# EAGLE design ECE411_G16_V7 (EAGLE 9.2.1)
Version 6: Added bypass capacitors to uC +Vcc, added test points for I2C.
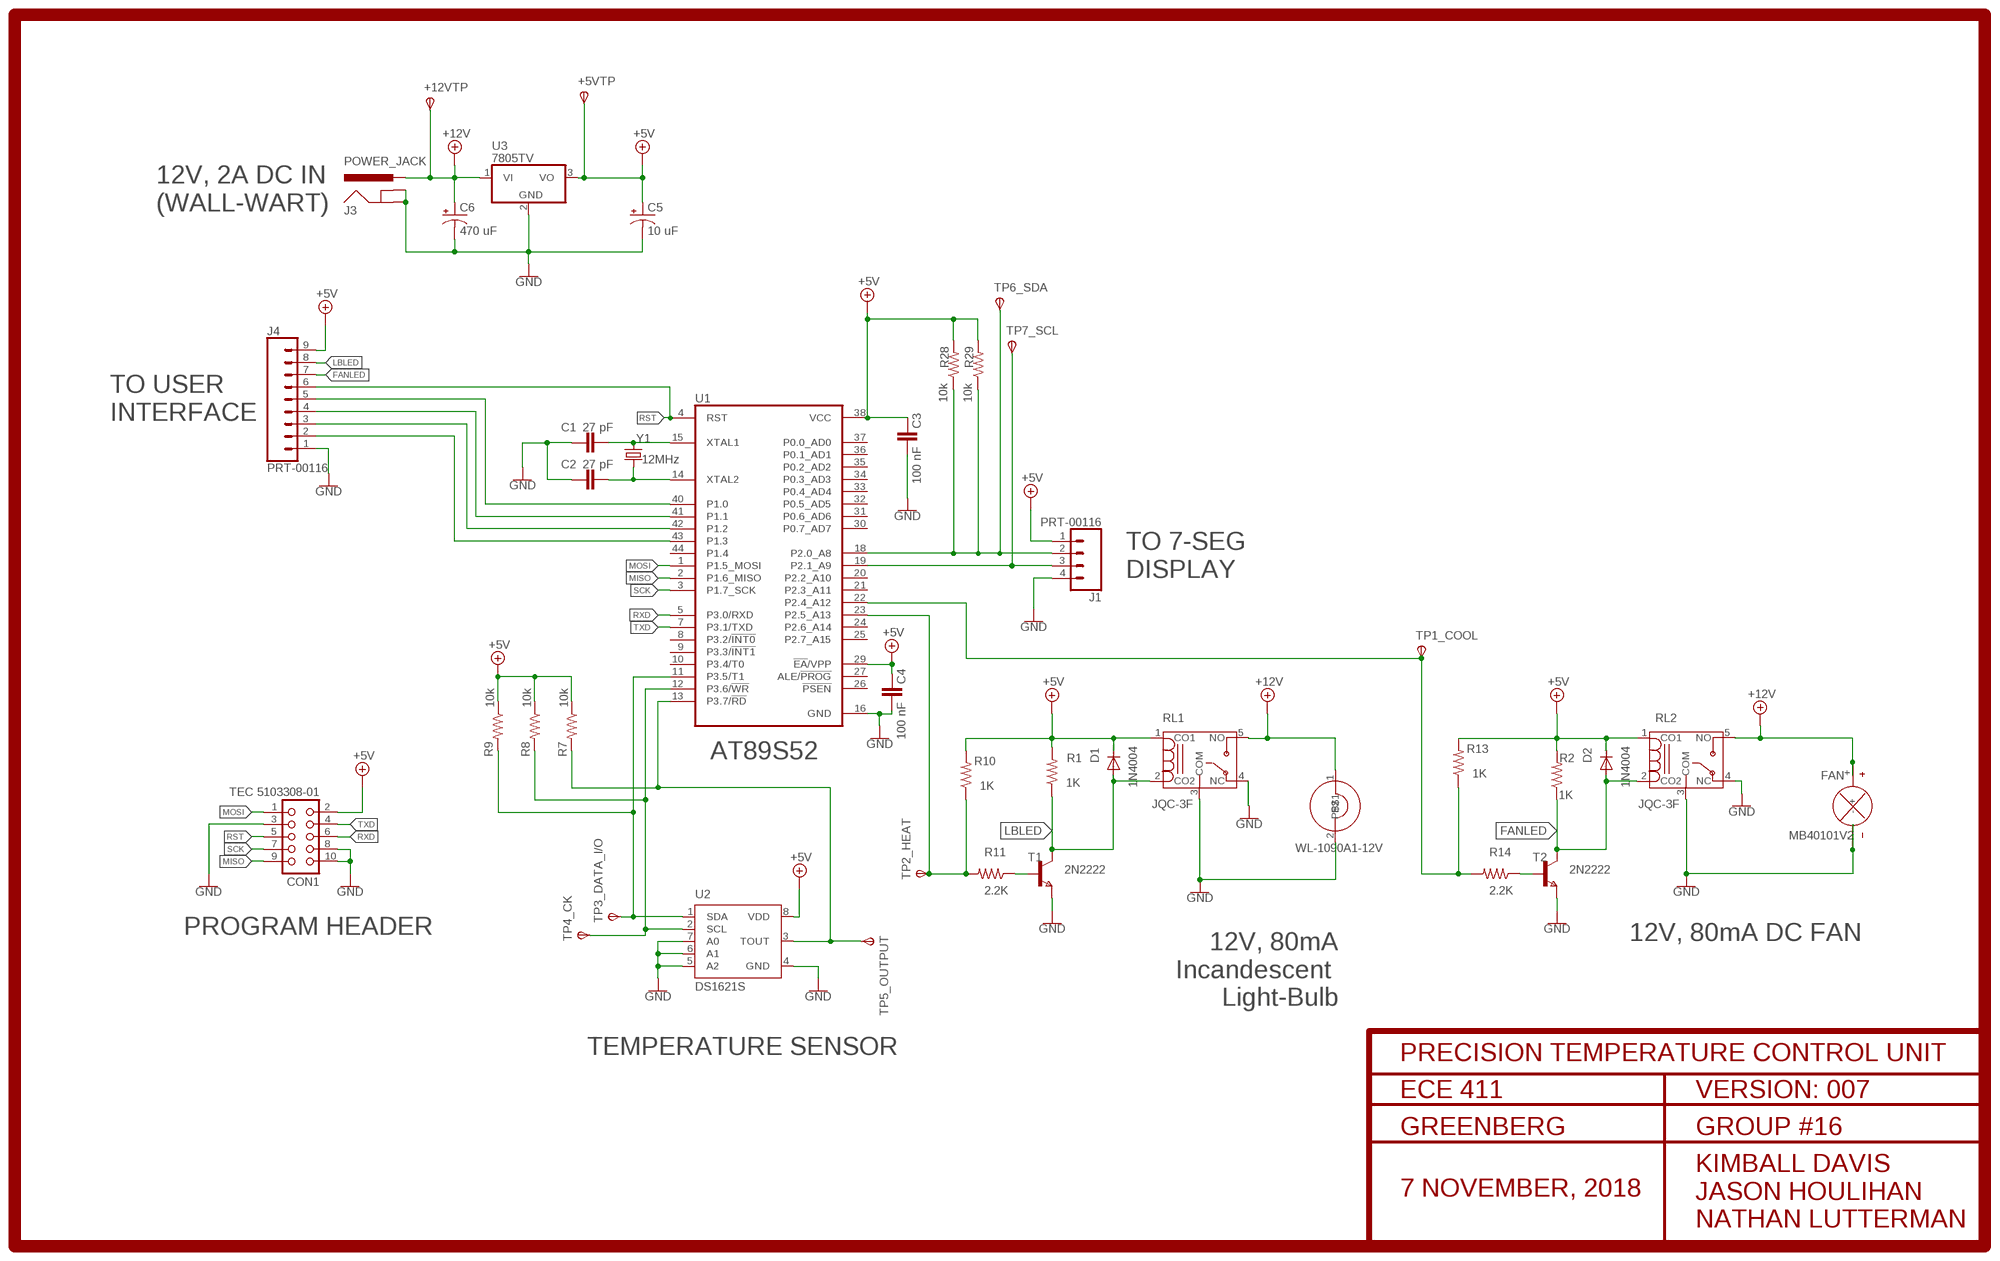
[diagram p0: schematic, sheet 1]

## Parts
+5VTP  TPSTP20SQ  [TP20SQ]
+12VTP  TPSTP20SQ  [TP20SQ]
C1  27 pF  CAPACITOR_0603_M  [RESC0603_M]
C2  27 pF  CAPACITOR_0603_M  [RESC0603_M]
C3  100 nF  CAPACITOR_0603_M  [RESC0603_M]
C4  100 nF  CAPACITOR_0603_M  [RESC0603_M]
C5  10 uF  CPOL-USTT2D6  [TT2D6]
C6  470 uF  CPOL-USTT5D11  [TT5D11]
CON1  TEC 5103308-01  CON10  [CON10]
D1  1N4004  [DO41-10]
D2  1N4004  [DO41-10]
J1  PRT-00116  CONN_04  [1X04]
J3  POWER_JACK  [POWER_JACK_PTH]
J4  PRT-00116  CONN_09  [1X09]
LIGHTBULB  LIGHTBULB  [JUMPER2]
MB40101V2  FAN  [FAN]
R1  1K  R-US_R0603  [R0603]
R2  1K  R-US_R0603  [R0603]
R7  10k  R-US_R0603  [R0603]
R8  10k  R-US_R0603  [R0603]
R9  10k  R-US_R0603  [R0603]
R10  1K  R-US_R0603  [R0603]
R11  2.2K  R-US_R0603  [R0603]
R13  1K  R-US_R0603  [R0603]
R14  2.2K  R-US_R0603  [R0603]
R28  10k  R-US_R0603  [R0603]
R29  10k  R-US_R0603  [R0603]
RL1  JQC-3F  [T073]
RL2  JQC-3F  [T073]
T1  2N2222  NPNSOT23  [SOT-23]
T2  2N2222  NPNSOT23  [SOT-23]
TP1_COOL  TPSTP20SQ  [TP20SQ]
TP2_HEAT  TPSTP20SQ  [TP20SQ]
TP3_DATA_I/O  TPSTP20SQ  [TP20SQ]
TP4_CK  TPSTP20SQ  [TP20SQ]
TP5_OUTPUT  TPSTP20SQ  [TP20SQ]
TP6_SDA  TPSTP20SQ  [TP20SQ]
TP7_SCL  TPSTP20SQ  [TP20SQ]
U1  AT89S52  AT89S51-24P  [TQFP44]
U2  DS1621S  [SO08]
U3  7805TV  [TO220V]
Y1  12MHz  CRYSTAL-12MHZ"  [CRYSTAL-SMD-5X3.2-4PAD]

## Nets
+5V: +5VTP.TP(PP) C3.2 C4.2 C5.+ CON1.2 D1.C D2.C J1.1 J4.9 R1.2 R2.2 R7.1 R8.1 R9.1 R10.2 R13.2 R28.2 R29.2 RL1.1(CO1) RL2.1(CO1) U1.29(!EA!/VPP) U1.38(VCC) U2.8(VDD) U3.3(VO)
+12V: +12VTP.TP(PP) C6.+ J3.PWR LIGHTBULB.1 MB40101V2.+ RL1.5(NO) RL2.5(NO) U3.1(VI)
FANLED: D2.A J4.7 R2.1 RL2.2(CO2) T2.1(C)
GND: C1.1 C2.1 C3.1 C4.1 C5.- C6.- CON1.3 CON1.8 CON1.10 J1.4 J3.GND J3.GNDBREAK J4.1 LIGHTBULB.2 MB40101V2.- RL1.3(COM) RL1.4(NC) RL2.3(COM) RL2.4(NC) T1.2(E) T2.2(E) U1.16(GND) U2.4(GND) U2.5(A2) U2.6(A1) U2.7(A0) U3.2(GND)
LBLED: D1.A J4.8 R1.1 RL1.2(CO2) T1.1(C)
MISO: CON1.9 U1.2(P1.6_MISO)
MOSI: CON1.1 U1.1(P1.5_MOSI)
N$1: C1.2 U1.15(XTAL1) Y1.1
N$2: C2.2 U1.14(XTAL2) Y1.3
N$3: J1.2 R28.1 R29.1 TP6_SDA.TP(PP) U1.18(P2.0_A8)
N$4: J1.3 TP7_SCL.TP(PP) U1.19(P2.1_A9)
N$9: R7.2 TP5_OUTPUT.TP(PP) U1.13(P3.7/!RD) U2.3(TOUT)
N$10: R8.2 TP4_CK.TP(PP) U1.12(P3.6/!WR) U2.2(SCL)
N$11: R9.2 TP3_DATA_I/O.TP(PP) U1.11(P3.5/T1) U2.1(SDA)
N$12: R10.1 R11.2 TP2_HEAT.TP(PP) U1.23(P2.5_A13)
N$13: R11.1 T1.3(B)
N$16: R13.1 R14.2 TP1_COOL.TP(PP) U1.22(P2.4_A12)
N$17: R14.1 T2.3(B)
N$34: J4.5 U1.40(P1.0)
N$35: J4.4 U1.41(P1.1)
N$36: J4.3 U1.42(P1.2)
N$37: J4.2 U1.43(P1.3)
RST: CON1.5 J4.6 U1.4(RST)
RXD: CON1.6 U1.5(P3.0/RXD)
SCK: CON1.7 U1.3(P1.7_SCK)
TXD: CON1.4 U1.7(P3.1/TXD)
Unconnected: U1.8(P3.2/!INT0) U1.9(P3.3/!INT1) U1.10(P3.4/T0) U1.20(P2.2_A10) U1.21(P2.3_A11) U1.24(P2.6_A14) U1.25(P2.7_A15) U1.26(!PSEN) U1.27(ALE/!PROG) U1.30(P0.7_AD7) U1.31(P0.6_AD6) U1.32(P0.5_AD5) U1.33(P0.4_AD4) U1.34(P0.3_AD3) U1.35(P0.2_AD2) U1.36(P0.1_AD1) U1.37(P0.0_AD0) U1.44(P1.4)

## Notes on the sheet
- 12V, 2A DC IN
  (WALL-WART)
- TO USER
  INTERFACE
- TO 7-SEG 
  DISPLAY
- AT89S52
- WL-1090A1-12V
- PROGRAM HEADER | 12V, 80mA DC FAN
- 12V, 80mA
  Incandescent 
  Light-Bulb
- TEMPERATURE SENSOR

## Power pins joined to a net without a drawn wire
GND: U1.17(GND)

## Library data of the parts
+5VTP +12VTP TP1_COOL TP2_HEAT TP3_DATA_I/O TP4_CK TP5_OUTPUT TP6_SDA TP7_SCL = testpad:TPS: TEST PIN
C1-C4 = Nordic_nRF:CAPACITOR: Generic chip capacitor
C5 C6 = rcl:CPOL-US: POLARIZED CAPACITOR, American symbol; SPICEPREFIX: C
CON1 = con-harting:CON10: CONNECTOR; OC_FARNELL: unknown; OC_NEWARK: unknown
D1 D2 = diode:1N4004: DIODE general purpose rectifier, 1 A
J1 = SparkFun-Connectors:CONN_04: Multi connection point. Often used as Generic Header-pin footprint for 0.1 inch spaced/style header connections On any of the 0.1 inch spaced packages, you can populate with these: Break Away Headers - Straight <https://www.sparkfun.com/products/116> (PRT-00116) Break Away Male Headers - Right Angle <https://www.sparkfun.com/products/553> (PRT-00553) Female Headers <https://www.sparkfun.com/products/115> (PRT-00115) Break Away Headers - Machine Pin <https://www.sparkfun.com/products/117> (PRT-00117) Break Away Female Headers - Swiss Machine Pin <https://www.sparkfun.com/products/743> (PRT-00743) For SCREWTERMINALS and SPRING TERMINALS visit here: Screw Terimnals on SparkFun.com <https://www.sparkfun.com/search/results?term=Screw+Terminals> (5mm/3.5mm/2.54mm spacing) This device is also useful as a general connection point to wire up your design to another part of your project. Our various solder wires solder well into these plated through hole pads. Hook-Up Wire - Assortment (Stranded, 22 AWG) <https://www.sparkfun.com/products/11375> (PRT-11375) Hook-Up Wire - Assortment (Solid Core, 22 AWG) <https://www.sparkfun.com/products/11367> (PRT-11367) View the entire wire category on our website here <https://www.sparkfun.com/categories/141> Special notes: Molex polarized connector foot print use with SKU : PRT-08231 with associated crimp pins and housings. 1MM SMD Version SKU: PRT-10208; PROD_ID: CONN-09696
J3 = SparkFun-Connectors:POWER_JACK: Power Jack Connector This is the standard 5.5mm barrel jack for power. The PTH is the most common, proven, reliable, footprint. The Slot footprint only works if the mill layer is transmitted to the PCB fab house so be warned. Here are the connectors we sell at SparkFun: DC Barrel Power Jack/Connector <https://www.sparkfun.com/products/119> (PRT-00119) DC Barrel Power Jack/Connector (SMD) <https://www.sparkfun.com/products/12748> (PRT-12748) DC Barrel Jack Adapter - Breadboard Compatible <https://www.sparkfun.com/products/10811> (PRT-10811) It is used on this SparkFun product (and many, many others): SparkFun RedBoard - Programmed with Arduino <https://www.sparkfun.com/products/12757> (DEV-12757) Also, if you need a mating power supply or connector, please check these out: Wall Adapter Power Supply - 9VDC 650mA <https://www.sparkfun.com/products/298> (TOL-00298) DC Barrel Jack Adapter - Male <https://www.sparkfun.com/products/10287> (PRT-10287); PROD_ID: CONN-08197
J4 = SparkFun-Connectors:CONN_09: Multi connection point. Often used as Generic Header-pin footprint for 0.1 inch spaced/style header connections On any of the 0.1 inch spaced packages, you can populate with these: Break Away Headers - Straight <https://www.sparkfun.com/products/116> (PRT-00116) Break Away Male Headers - Right Angle <https://www.sparkfun.com/products/553> (PRT-00553) Female Headers <https://www.sparkfun.com/products/115> (PRT-00115) Break Away Headers - Machine Pin <https://www.sparkfun.com/products/117> (PRT-00117) Break Away Female Headers - Swiss Machine Pin <https://www.sparkfun.com/products/743> (PRT-00743) For SCREWTERMINALS and SPRING TERMINALS visit here: Screw Terimnals on SparkFun.com <https://www.sparkfun.com/search/results?term=Screw+Terminals> (5mm/3.5mm/2.54mm spacing) This device is also useful as a general connection point to wire up your design to another part of your project. Our various solder wires solder well into these plated through hole pads. Hook-Up Wire - Assortment (Stranded, 22 AWG) <https://www.sparkfun.com/products/11375> (PRT-11375) Hook-Up Wire - Assortment (Solid Core, 22 AWG) <https://www.sparkfun.com/products/11367> (PRT-11367) View the entire wire category on our website here <https://www.sparkfun.com/categories/141> Special notes: Molex polarized connector foot print use with SKU : PRT-08231 with associated crimp pins and housings. 1MM SMD Version SKU: PRT-10208 NOTES ON THE VARIANTS LOCK and LOCK_LONGPADS... This footprint was designed to help hold the alignment of a through-hole component (i.e. 6-pin header) while soldering it into place. You may notice that each hole has been shifted either up or down by 0.005 of an inch from it's more standard position (which is a perfectly straight line). This slight alteration caused the pins (the squares in the middle) to touch the edges of the holes. Because they are alternating, it causes a "brace" to hold the component in place. 0.005 has proven to be the perfect amount of "off-center" position when using our standard breakaway headers. Although looks a little odd when you look at the bare footprint, once you have a header in there, the alteration is very hard to notice. Also,if you push a header all the way into place, it is covered up entirely on the bottom side.
LIGHTBULB = LIGHTBULB:LIGHTBULB
MB40101V2 = FAN:FAN
R1 R2 R7-R11 R13 R14 R28 R29 = audio amplifier example:R-US_: RESISTOR, American symbol
RL1 RL2 = JQC-3F:JQC-3F
T1 T2 = zetex:NPNSOT23: NPN TRANSISTOR; MPN: DSS20201L-7; OC_FARNELL: 1710688; OC_NEWARK: 25R4555
U1 = atmel:AT89S51*P: 8-bit Microcontroller with 4K BytesIn-System Programmable Flash Source: http://www.atmel.com/dyn/resources/prod_documents/doc2487.pdf; OC_FARNELL: unknown; OC_NEWARK: unknown
U2 = maxim:DS1621: Digital Thermometer and Thermostat Source: http://pdfserv.maxim-ic.com/en/ds/DS1621.pdf; MF: DALLAS SEMICONDUCTOR; MPN: DS1621S+; OC_FARNELL: 9725261; OC_NEWARK: 23K3501
U3 = linear:78*: Positive VOLTAGE REGULATOR Source: http://cache.national.com/ds/LM/LM78L05.pdf http://www.fairchildsemi.com/ds/LM/LM7805.pdf
Y1 = SparkFun-Clocks:CRYSTAL-12MHZ: 12.0MHz Crystal Frequency: 12.0MHz Frequency Tolerance: ±20ppm Load Capacitance: 18pF SparkFun Products: SparkFun Logomatic <https://www.sparkfun.com/products/12772> Pocket AVR Programmer <https://www.sparkfun.com/products/9825>; PROD_ID: XTAL-08297

## Board
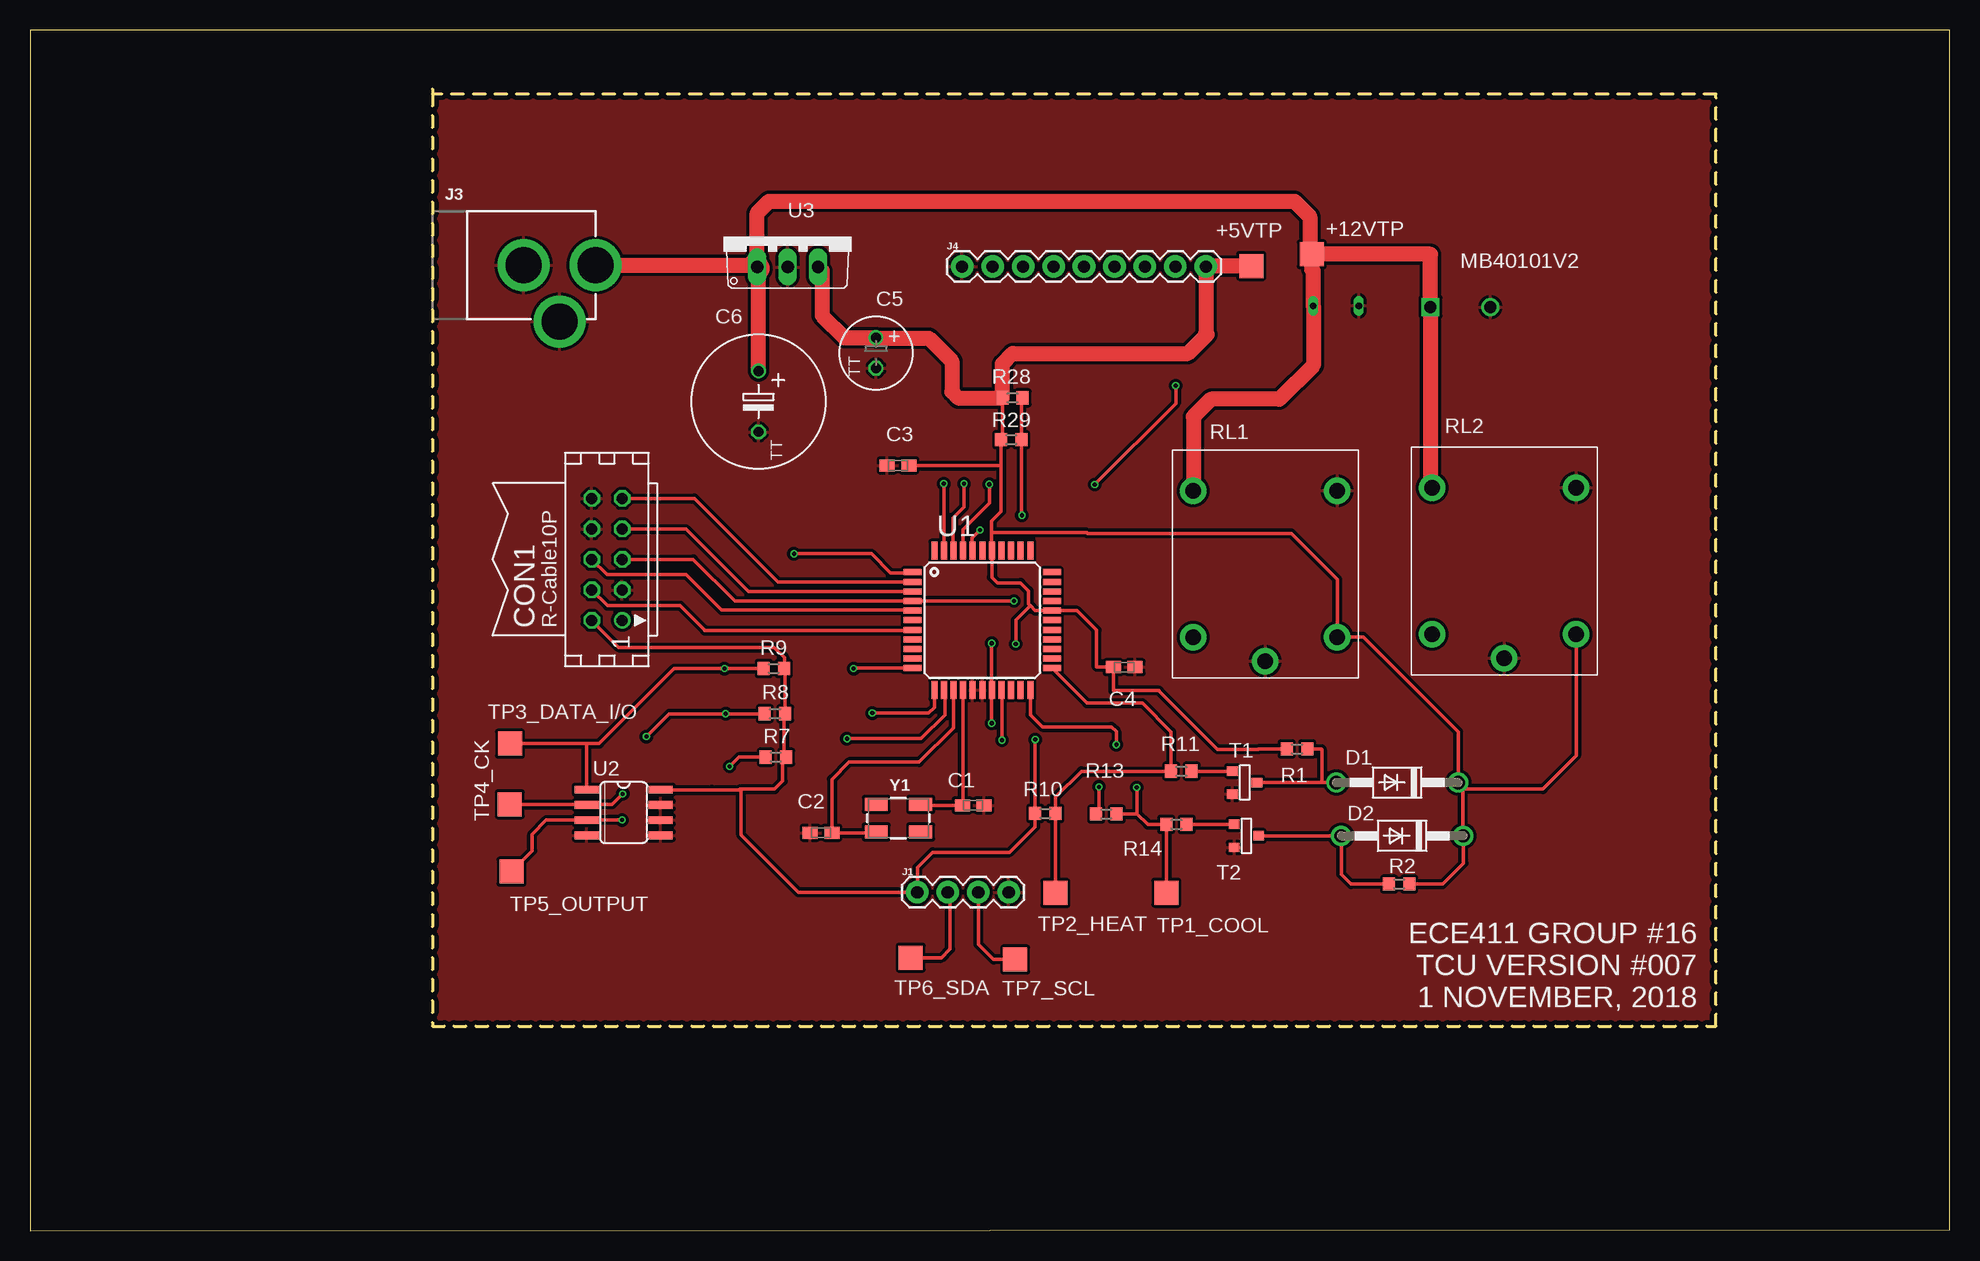
[diagram p1: board, top side]
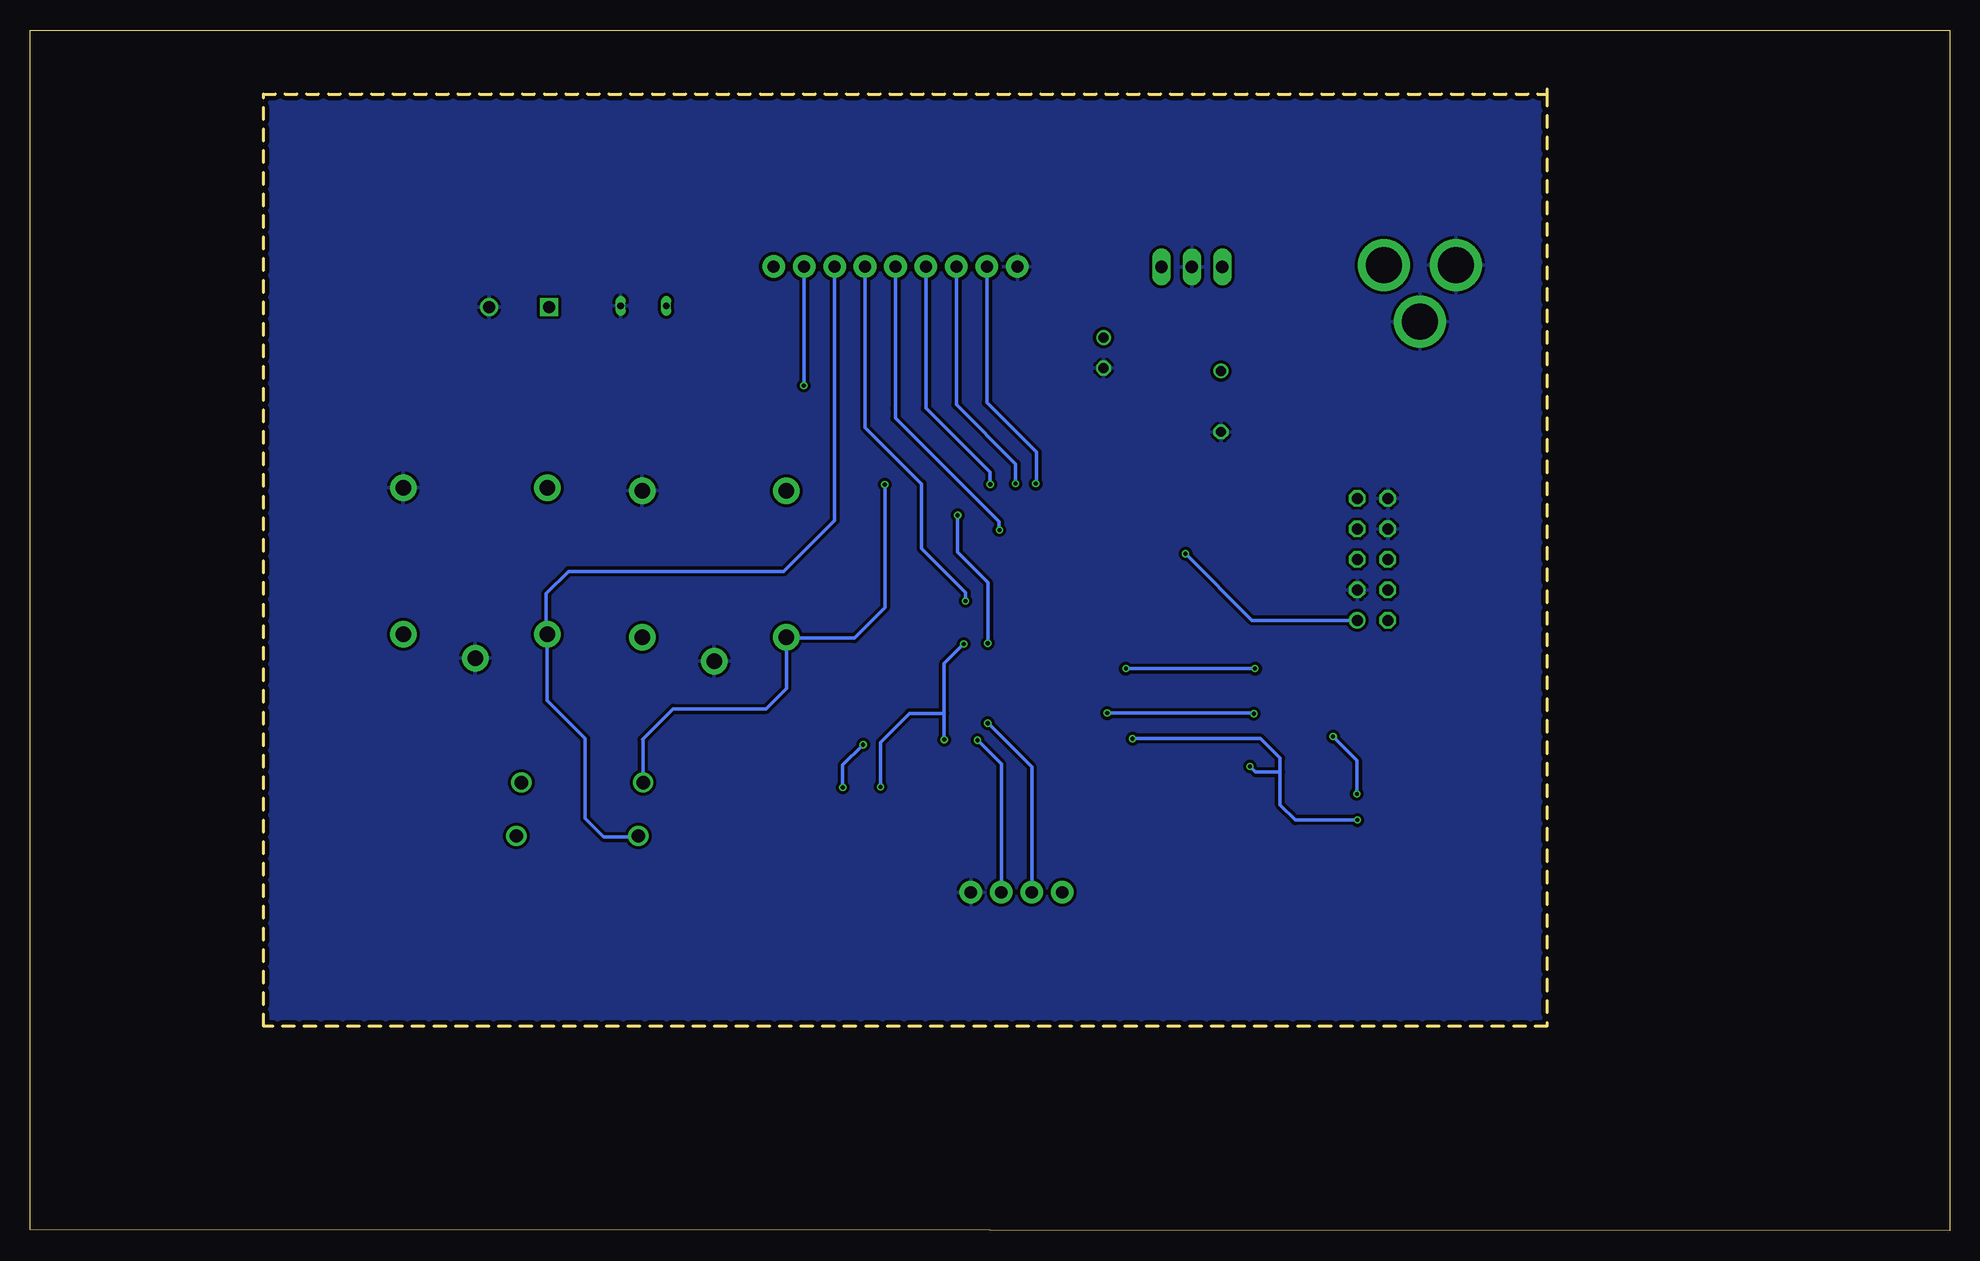
[diagram p2: board, bottom side, seen from below]

Size 160 x 100.11 mm. Coordinates in mm from the lower left corner, seen from the top.
Outline: 33.55,95.21 33.55,94.77
Outline: 33.55,94.77 33.55,17.05 140.54,17.05 140.54,94.77 33.55,94.77
Outline: 0,0 160,0.11 160,100.11 0,100.11 0,0
Copper layers (1*16): Top 0.035559375mm / dielectric 1.6mm / Bottom 0.035559375mm
Design rules "2LAYER": minimum track width 6mil, minimum drill 10mil, track to track 6mil, track to pad 6mil, pad to pad 6mil, via to via 6mil, smd to smd 6mil, copper to edge 15mil, drill to drill 6mil, minimum pad ring 5mil, minimum via ring 5mil, stop-mask expansion 2.5mil, vias tented up to drill 0mil, thermal gap 10mil

### Footprints (pad centres in the part's own frame; a part is rotated, then mirrored left to right if it is on the bottom)
TP20SQ = smd 2 x 2: TP 0,0
RESC0603_M = smd 1.25 x 1: 1 -0.9,0; 2 0.9,0
TT2D6 = drill 0.813: + -1.27,0 | drill 0.813 octagon: - 1.27,0
TT5D11 = drill 0.813: + -2.54,0 | drill 0.813 octagon: - 2.54,0
CON10 = drill 0.914: 1 -5.08,-1.27 | drill 0.914 octagon: 2 -5.08,1.27; 3 -2.54,-1.27; 4 -2.54,1.27; 5 0,-1.27; 6 0,1.27; 7 2.54,-1.27; 8 2.54,1.27; 9 5.08,-1.27; 10 5.08,1.27
DO41-10 = drill 1.118: A 5.08,0; C -5.08,0
1X04 = drill 1.016 pad 1.88: 1 0,0; 2 2.54,0; 3 5.08,0; 4 7.62,0
POWER_JACK_PTH = drill 2.997 pad 4.318: GND 0,7.7; GNDBREAK 4.7,10.7; PWR 0,13.7
1X09 = drill 1.016 pad 1.88: 1 0,0; 2 2.54,0; 3 5.08,0; 4 7.62,0; 5 10.16,0; 6 12.7,0; 7 15.24,0; 8 17.78,0; 9 20.32,0
JUMPER2 = drill 0.55 long: 1 0,3.81; 2 0,0
FAN = drill 1 square: + -2.5,0 | drill 1: - 2.5,0
R0603 = smd 1 x 1.1: 1 -0.85,0; 2 0.85,0
T073 = drill 1.3 pad 2.2: 1 6.1,6; 2 6.1,-6; 3 8.1,0; 4 -6.1,6; 5 -6.1,-6
SOT-23 = smd 0.787 x 0.889: 1 0.025,-1.016; 2 -0.94,1.016; 3 0.991,1.016
TQFP44 = smd 1.5 x 0.5: 1 -5.8,4; 2 -5.8,3.2; 3 -5.8,2.4; 4 -5.8,1.6; 5 -5.8,0.8; 6 -5.8,0; 7 -5.8,-0.8; 8 -5.8,-1.6; 9 -5.8,-2.4; 10 -5.8,-3.2; 11 -5.8,-4; 23 5.8,-4; 24 5.8,-3.2; 25 5.8,-2.4; 26 5.8,-1.6; 27 5.8,-0.8; 28 5.8,0; 29 5.8,0.8; 30 5.8,1.6; 31 5.8,2.4; 32 5.8,3.2; 33 5.8,4 | smd 0.5 x 1.5: 12 -4,-5.8; 13 -3.2,-5.8; 14 -2.4,-5.8; 15 -1.6,-5.8; 16 -0.8,-5.8; 17 0,-5.8; 18 0.8,-5.8; 19 1.6,-5.8; 20 2.4,-5.8; 21 3.2,-5.8; 22 4,-5.8; 34 4,5.8; 35 3.2,5.8; 36 2.4,5.8; 37 1.6,5.8; 38 0.8,5.8; 39 0,5.8; 40 -0.8,5.8; 41 -1.6,5.8; 42 -2.4,5.8; 43 -3.2,5.8; 44 -4,5.8
SO08 = smd 0.66 x 2.032: 1 -1.905,-3.073; 2 -0.635,-3.073; 3 0.635,-3.073; 4 1.905,-3.073; 5 1.905,3.073; 6 0.635,3.073; 7 -0.635,3.073; 8 -1.905,3.073
TO220V = drill 1.016 long: 1 -2.54,-2.54; 2 0,-2.54; 3 2.54,-2.54
CRYSTAL-SMD-5X3.2-4PAD = smd 1.9 x 1.1: 1 -1.85,-1.15; 2 1.85,-1.15; 3 1.85,1.15; 4 -1.85,1.15

### Placement (x,y rotation side)
+5VTP  101.81,80.43 0 top
+12VTP  106.84,81.41 0 top
C1  78.61,35.48 180 top
C2  65.93,33.19 0 top
C3  72.35,63.8 0 top
C4  91.21,47 180 top
C5  70.52,73.19 270 top
C6  60.73,69.14 270 top
CON1  48.1,55.97 90 top
D1  113.97,37.37 180 top
D2  114.38,32.92 180 top
J1  73.96,28.22 0 top
J3  33.45,80.5 270 top
J4  77.69,80.38 0 top
LIGHTBULB  110.77,77.12 90 top
MB40101V2  119.24,77.01 0 top
R1  105.61,40.16 180 top
R2  114.12,28.91 0 top
R7  62.17,39.49 180 top
R8  62.09,43.11 180 top
R9  62,46.88 180 top
R10  84.62,34.79 180 top
R11  95.97,38.31 180 top
R13  89.71,34.74 180 top
R14  95.56,33.88 180 top
R28  81.89,69.44 180 top
R29  81.79,65.95 180 top
RL1  102.97,55.6 270 top
RL2  122.89,55.85 270 top
T1  101.25,37.34 90 top
T2  101.39,32.9 90 top
TP1_COOL  94.71,28.17 0 top
TP2_HEAT  85.48,28.17 0 top
TP3_DATA_I/O  40,40.62 180 top
TP4_CK  39.99,35.55 180 top
TP5_OUTPUT  40.13,29.95 0 top
TP6_SDA  73.41,22.77 0 top
TP7_SCL  82.12,22.61 0 top
U1  79.38,50.91 0 top
U2  49.49,34.87 270 top
U3  63.16,82.89 0 top
Y1  72.39,34.4 180 top

### Tracks (layer width: path | path; a pad name or v marks a point on that pad's centre or on a via)
+5V  (via drill 0.35)
  Top 0.305: 80.94,63.86 R29.2 81.05,66.06 R28.2 | 80.94,63.86 80.94,59.97 80.16,59.19 80.16,58.2 | 80.16,58.2 80.16,56.72 U1.38 80.17,54.48 80.64,54.01 82.58,54.01 83.24,53.35 83.24,52.25 83.38,52.12 | 80.16,58.2 88.09,58.2 88.14,58.15 105.13,58.15 108.97,54.31 RL1.1 108.98,49.51 111.12,49.51 119.05,41.59 D1.C | 83.38,52.12 83.78,51.71 U1.29 87.26,51.71 88.9,50.07 88.9,47.02 90.29,47.02 C4.2 90.3,46.98 90.3,45.04 94.11,45.04 94.11,45.02 98.98,40.14 102.39,40.14 102.41,40.16 R1.2 | CON1.2 49.08,48.65 62.03,48.65 62.89,47.78 62.89,46.92 R9.1 62.95,46.78 R8.1 62.84,43.01 62.84,39.67 | 62.84,39.67 R7.1 | 62.84,39.67 62.74,39.77 62.74,37.5 62.07,36.83 59.21,36.83 59.26,36.77 | U2.8 56.82,36.77 59.26,36.77 | 59.26,36.77 59.28,36.75 59.28,33 64.06,28.22 J1.1 73.96,30.28 75.23,31.55 81.64,31.55 83.77,33.69 R10.2 83.77,40.93 v83.8,40.95 | v82.17,48.93 82.17,50.91 83.38,52.12 | v89.1,37.01 89.1,34.98 R13.2 | D1.C 119.45,37.37 D2.C 119.48,32.9 119.48,30.64 117.75,28.91 R2.2 | RL2.1 128.88,39.61 126.11,36.84 119.58,36.84 D1.C | C3.2 80.88,63.8 80.94,63.86
  Top 1.27: U3.3 66.04,80.01 66.04,76.31 67.89,74.46 C5.+ 70.57,74.4 74.93,74.4 76.83,72.5 76.83,69.96 77.36,69.44 R28.2 81.05,72.26 81.92,73.13 96.52,73.13 98.11,74.72 98.02,74.81 J4.9 98.06,80.43 +5VTP.TP
  Bottom 0.305: v83.8,40.95 83.8,43.14 | 83.8,43.14 83.8,47.3 v82.17,48.93 | 83.8,43.14 86.69,43.14 89.1,40.72 v89.1,37.01
+12V
  Top 1.27: C6.+ 60.73,80.25 U3.1 60.62,84.86 61.59,85.83 105.41,85.83 106.68,84.56 106.68,81.57 +12VTP.TP | +12VTP.TP 106.84,80.14 106.96,80.02 LIGHTBULB.1 106.96,72.14 104.14,69.32 98.42,69.32 96.97,67.87 RL1.5 | RL2.5 117.02,62.08 116.74,62.08 MB40101V2.+ 116.74,81.41 +12VTP.TP | J3.PWR 60.47,80.51
  Top 1.905: 60.47,80.51 60.73,80.25
FANLED
  Top 0.305: T2.1 D2.A 109.3,29.72 110.11,28.91 R2.1
  Bottom 0.305: J4.7 92.94,59.22 97.18,54.97 115.11,54.97 116.97,53.12 116.97,49.83 RL2.2 116.89,44.2 113.72,41.03 113.72,34.37 112.19,32.85 109.12,32.85 109.07,32.9 109.27,32.9 D2.A
GND
  pour Bottom (isolate 0.254): 31.18,96.09 31.18,15.75 141.63,15.75 141.63,96.31 31.18,96.31
  pour Top (isolate 0.254): 32.79,16.24 141.4,16.24 141.4,21.01 141.4,95.66 140.74,95.66 32.79,95.66 32.79,95.1
LBLED  (via drill 0.35)
  Top 0.305: v95.5,70.47 95.5,68.97 v88.75,62.21 | D1.A 107.8,37.37 | T1.1 107.8,37.37 | R1.1 107.64,40.16 107.67,40.14 107.67,37.5 107.8,37.37
  Bottom 0.305: J4.8 95.47,70.5 v95.5,70.47 | v88.75,62.21 88.75,51.95 91.29,49.41 96.88,49.41 96.9,49.43 | 96.9,49.43 RL1.2 | D1.A 108.89,40.9 108.94,40.95 106.38,43.52 98.63,43.52 96.95,45.19 96.95,49.38 96.9,49.43
MISO
  Top 0.305: CON1.9 55.39,61.05 62.36,54.08 73.55,54.08 U1.2
MOSI  (via drill 0.35)
  Top 0.305: v63.68,56.45 70.13,56.45 71.73,54.85 73.51,54.85 U1.1
  Bottom 0.305: CON1.1 58.13,50.89 v63.68,56.45
N$1
  Top 0.305: Y1.1 74.31,35.48 C1.2 77.78,35.54 U1.15
N$2
  Top 0.305: Y1.3 70.48,33.19 C2.2 66.83,37.63 68.28,39.07 74.12,39.07 76.97,41.93 U1.14
N$3  (via drill 0.35)
  Top 0.305: v82.68,59.65 82.64,59.68 R29.1 82.64,69.44 R28.1 | v80.16,48.98 80.16,45.12 | 80.16,45.12 U1.18 | v80.16,42.32 80.16,45.12 | TP6_SDA.TP 75.97,22.77 76.71,23.5 76.71,28.02 J1.2
  Bottom 0.305: v82.68,59.65 82.68,56.57 80.16,54.06 v80.16,48.98 | J1.2 76.5,38.66 v80.16,42.32
N$4  (via drill 0.35)
  Top 0.305: v81.03,40.9 81.03,45.06 U1.19 | TP7_SCL.TP 80.31,22.61 79.05,23.88 J1.3
  Bottom 0.305: J1.3 79.04,38.91 v81.03,40.9
N$9  (via drill 0.35)
  Top 0.305: TP5_OUTPUT.TP 41.86,31.68 41.86,33.05 43.04,34.23 U2.3 49.34,34.23 v49.35,34.25 | v68.1,41.03 74.27,41.03 76.25,43.01 76.25,45.03 U1.13 | R7.2 59.09,39.49 v58.32,38.72
  Bottom 0.305: v49.35,34.25 54.53,34.25 55.8,35.52 55.8,38.23 | 55.8,38.23 55.8,39.4 57.43,41.03 v68.1,41.03 | v58.32,38.72 57.84,38.23 55.8,38.23
N$10  (via drill 0.35)
  Top 0.305: TP4_CK.TP 46.46,35.55 | 46.46,35.55 U2.2 | R8.2 v57.99,43.11 53.29,43.11 v51.38,41.21 | v49.4,36.43 48.53,35.55 46.46,35.55 | U1.12 75.38,43.63 74.91,43.16 v70.21,43.16
  Bottom 0.305: v51.38,41.21 49.4,39.22 v49.4,36.43 | v70.21,43.16 58.04,43.16 v57.99,43.11
N$11  (via drill 0.35)
  Top 0.305: TP3_DATA_I/O.TP 46.41,40.62 | 46.41,40.62 47.45,40.62 53.7,46.87 v57.89,46.87 R9.2 | U2.1 46.41,40.62 | U1.11 68.69,46.91 v68.66,46.87
  Bottom 0.305: v68.66,46.87 v57.89,46.87
N$12
  Top 0.305: TP2_HEAT.TP R10.1 85.47,36.15 87.63,38.31 R11.2 95.11,41.59 92.71,44 88.08,44 U1.23
N$13
  Top 0.305: R11.1 100.22,38.31 T1.3
N$16  (via drill 0.35)
  Top 0.305: TP1_COOL.TP R14.2 94.7,33.87 93.17,33.87 92.29,34.74 | R13.1 92.29,34.74 | U1.22 83.38,43.02 84.38,42.02 90.14,42.02 90.55,41.61 v90.55,40.52 | v92.25,36.96 92.25,34.78 92.29,34.74
  Bottom 0.305: v90.55,40.52 92.25,38.82 v92.25,36.96
N$17
  Top 0.305: R14.1 100.36,33.88 T2.3
N$34  (via drill 0.35)
  Top 0.305: v79.2,58.43 78.54,57.77 78.54,56.75 U1.40
  Bottom 0.305: J4.5 87.86,68.57 87.86,68.56 87.86,67.75 79.25,59.14 79.25,58.48 v79.2,58.43
N$35  (via drill 0.35)
  Top 0.305: v79.96,62.24 79.96,60.66 77.78,58.48 U1.41
  Bottom 0.305: J4.4 85.31,68.58 79.98,63.25 79.98,62.24 v79.96,62.24
N$36  (via drill 0.35)
  Top 0.305: v77.85,62.29 77.85,60.33 76.94,59.42 76.94,56.75 U1.42
  Bottom 0.305: J4.3 82.78,68.86 77.85,63.94 v77.85,62.29
N$37  (via drill 0.35)
  Top 0.305: v76.17,62.29 U1.43 | U1.43
  Bottom 0.305: J4.2 80.23,69.04 76.1,64.9 76.1,62.54 76.22,62.41 76.22,62.34 v76.17,62.29
RST  (via drill 0.35)
  Top 0.305: v82.02,52.51 U1.4 | U1.4 | CON1.5 55.28,55.97 58.75,52.51 U1.4 | U1.4
  Bottom 0.305: J4.6 90.39,66.98 85.67,62.26 85.67,56.88 82.02,53.22 v82.02,52.51
RXD
  Top 0.305: U1.5 73.51,51.65 73.41,51.75 57.66,51.75 54.69,54.72 48.09,54.72 CON1.6
SCK
  Top 0.305: CON1.7 49.38,58.5 54.69,58.5 59.89,53.3 73.56,53.3 U1.3
TXD
  Top 0.305: U1.7 73.51,50.04 56.24,50.04 56.24,50.1 54.2,52.13 48.14,52.13 CON1.4

### Text on the board
tPlace: ECE411 GROUP #16 / TCU VERSION #007 / 1 NOVEMBER, 2018